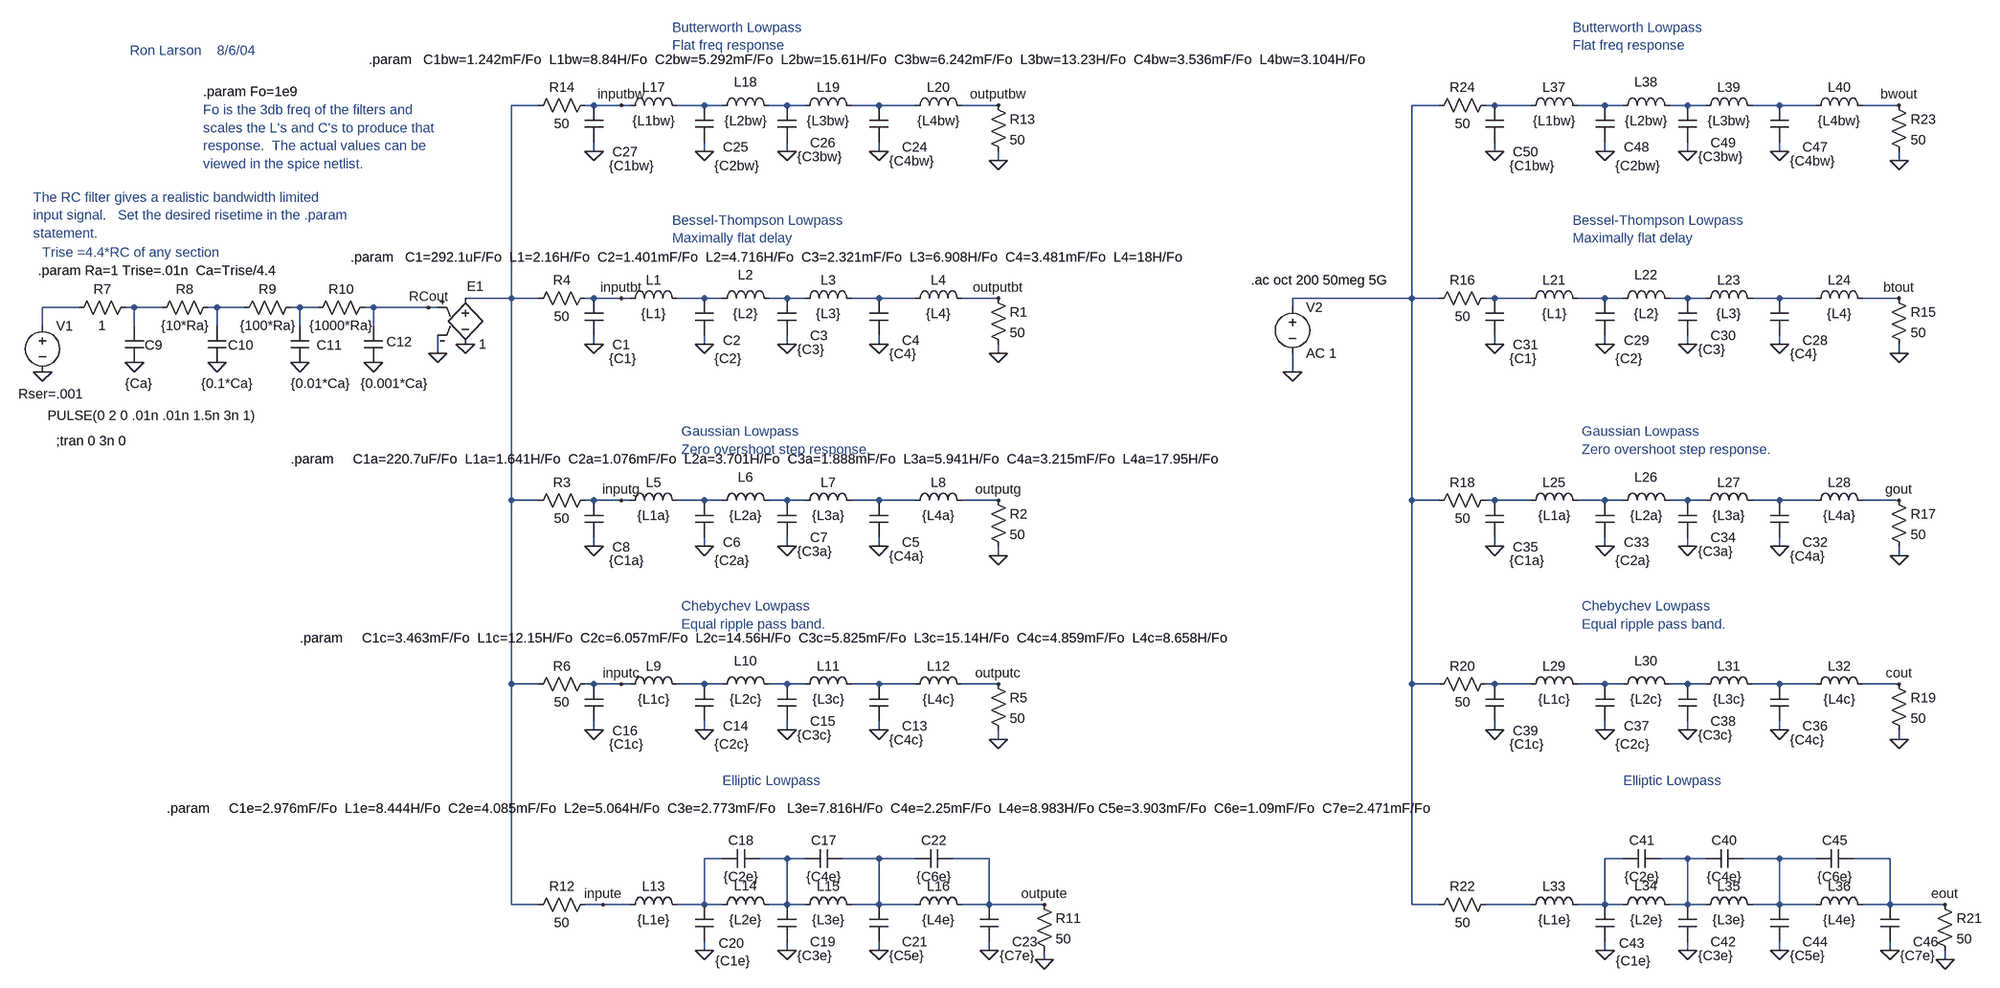
[diagram p0: schematic filters_galore.asc]
filters_galore.asc, the LTspice schematic file:
Version 4
SHEET 1 1564 1292
WIRE -592 112 -560 112
WIRE -832 112 -848 112
WIRE -1856 160 -1856 128
WIRE -992 112 -1040 112
WIRE -192 208 -192 192
WIRE -848 112 -896 112
WIRE -400 112 -336 112
WIRE -400 176 -400 192
WIRE -752 112 -704 112
WIRE -704 176 -704 192
WIRE -704 112 -672 112
WIRE -448 112 -400 112
WIRE -560 176 -560 192
WIRE -560 112 -528 112
WIRE -256 112 -192 112
WIRE -1280 128 -1184 128
WIRE -1184 128 -1168 128
WIRE -1168 176 -1168 208
WIRE -1856 128 -1792 128
WIRE -1712 128 -1696 128
WIRE -1696 160 -1696 128
WIRE -1696 128 -1648 128
WIRE -1568 128 -1552 128
WIRE -1552 160 -1552 128
WIRE -1552 128 -1504 128
WIRE -1424 128 -1408 128
WIRE -1296 128 -1280 128
WIRE -1280 128 -1280 160
WIRE -1408 160 -1408 128
WIRE -1408 128 -1376 128
WIRE -896 176 -896 192
WIRE -896 112 -912 112
WIRE -592 464 -560 464
WIRE -832 464 -848 464
WIRE -192 560 -192 544
WIRE -848 464 -896 464
WIRE -400 464 -336 464
WIRE -400 528 -400 544
WIRE -752 464 -704 464
WIRE -704 528 -704 544
WIRE -704 464 -672 464
WIRE -448 464 -400 464
WIRE -560 528 -560 544
WIRE -560 464 -528 464
WIRE -256 464 -192 464
WIRE -896 528 -896 544
WIRE -896 464 -912 464
WIRE -992 464 -1040 464
WIRE -1040 464 -1040 112
WIRE -1040 112 -1120 112
WIRE -592 784 -560 784
WIRE -832 784 -848 784
WIRE -192 880 -192 864
WIRE -848 784 -896 784
WIRE -400 784 -336 784
WIRE -400 848 -400 864
WIRE -752 784 -704 784
WIRE -704 848 -704 864
WIRE -704 784 -672 784
WIRE -448 784 -400 784
WIRE -560 848 -560 864
WIRE -560 784 -528 784
WIRE -256 784 -192 784
WIRE -896 848 -896 864
WIRE -896 784 -912 784
WIRE -992 784 -1040 784
WIRE -1040 784 -1040 464
WIRE -592 1168 -560 1168
WIRE -832 1168 -880 1168
WIRE -112 1264 -112 1248
WIRE -448 1168 -400 1168
WIRE -400 1232 -400 1248
WIRE -752 1168 -704 1168
WIRE -704 1232 -704 1248
WIRE -560 1232 -560 1248
WIRE -560 1168 -528 1168
WIRE -256 1168 -208 1168
WIRE -992 1168 -1040 1168
WIRE -1040 1168 -1040 784
WIRE -704 1168 -672 1168
WIRE -880 1168 -912 1168
WIRE -400 1168 -336 1168
WIRE -208 1232 -208 1248
WIRE -208 1168 -112 1168
WIRE -704 1168 -704 1088
WIRE -704 1088 -672 1088
WIRE -608 1088 -560 1088
WIRE -464 1088 -400 1088
WIRE -272 1088 -208 1088
WIRE -208 1088 -208 1168
WIRE -400 1168 -400 1088
WIRE -400 1088 -336 1088
WIRE -560 1168 -560 1088
WIRE -560 1088 -528 1088
WIRE -592 -224 -560 -224
WIRE -832 -224 -848 -224
WIRE -192 -128 -192 -144
WIRE -848 -224 -896 -224
WIRE -400 -224 -336 -224
WIRE -400 -160 -400 -144
WIRE -752 -224 -704 -224
WIRE -704 -160 -704 -144
WIRE -704 -224 -672 -224
WIRE -448 -224 -400 -224
WIRE -560 -160 -560 -144
WIRE -560 -224 -528 -224
WIRE -256 -224 -192 -224
WIRE -896 -160 -896 -144
WIRE -896 -224 -912 -224
WIRE -1040 112 -1040 -224
WIRE -1040 -224 -992 -224
WIRE 976 112 1008 112
WIRE 736 112 672 112
WIRE 576 112 528 112
WIRE 1376 208 1376 192
WIRE 1168 112 1232 112
WIRE 1168 176 1168 192
WIRE 816 112 864 112
WIRE 864 176 864 192
WIRE 864 112 896 112
WIRE 1120 112 1168 112
WIRE 1008 176 1008 192
WIRE 1008 112 1040 112
WIRE 1312 112 1376 112
WIRE 672 176 672 192
WIRE 672 112 656 112
WIRE 976 464 1008 464
WIRE 736 464 672 464
WIRE 1376 560 1376 544
WIRE 1168 464 1232 464
WIRE 1168 528 1168 544
WIRE 816 464 864 464
WIRE 864 528 864 544
WIRE 864 464 896 464
WIRE 1120 464 1168 464
WIRE 1008 528 1008 544
WIRE 1008 464 1040 464
WIRE 1312 464 1376 464
WIRE 672 528 672 544
WIRE 672 464 656 464
WIRE 576 464 528 464
WIRE 528 464 528 112
WIRE 976 784 1008 784
WIRE 736 784 672 784
WIRE 1376 880 1376 864
WIRE 1168 784 1232 784
WIRE 1168 848 1168 864
WIRE 816 784 864 784
WIRE 864 848 864 864
WIRE 864 784 896 784
WIRE 1120 784 1168 784
WIRE 1008 848 1008 864
WIRE 1008 784 1040 784
WIRE 1312 784 1376 784
WIRE 672 848 672 864
WIRE 672 784 656 784
WIRE 576 784 528 784
WIRE 528 784 528 464
WIRE 976 1168 1008 1168
WIRE 736 1168 656 1168
WIRE 1456 1264 1456 1248
WIRE 1120 1168 1168 1168
WIRE 1168 1232 1168 1248
WIRE 816 1168 864 1168
WIRE 864 1232 864 1248
WIRE 1008 1232 1008 1248
WIRE 1008 1168 1040 1168
WIRE 1312 1168 1360 1168
WIRE 576 1168 528 1168
WIRE 528 1168 528 784
WIRE 864 1168 896 1168
WIRE 1168 1168 1232 1168
WIRE 1360 1232 1360 1248
WIRE 1360 1168 1456 1168
WIRE 864 1168 864 1088
WIRE 864 1088 896 1088
WIRE 960 1088 1008 1088
WIRE 1104 1088 1168 1088
WIRE 1296 1088 1360 1088
WIRE 1360 1088 1360 1168
WIRE 1168 1168 1168 1088
WIRE 1168 1088 1232 1088
WIRE 1008 1168 1008 1088
WIRE 1008 1088 1040 1088
WIRE 976 -224 1008 -224
WIRE 736 -224 672 -224
WIRE 1376 -128 1376 -144
WIRE 1168 -224 1232 -224
WIRE 1168 -160 1168 -144
WIRE 816 -224 864 -224
WIRE 864 -160 864 -144
WIRE 864 -224 896 -224
WIRE 1120 -224 1168 -224
WIRE 1008 -160 1008 -144
WIRE 1008 -224 1040 -224
WIRE 1312 -224 1376 -224
WIRE 672 -160 672 -144
WIRE 672 -224 656 -224
WIRE 528 112 528 -224
WIRE 528 -224 576 -224
WIRE 320 240 320 208
WIRE 320 128 320 112
WIRE 320 112 528 112
FLAG -192 208 0
FLAG -1856 240 0
FLAG -848 112 inputbt
FLAG -192 112 outputbt
FLAG -400 192 0
FLAG -704 192 0
FLAG -560 192 0
FLAG -1120 192 0
FLAG -1168 208 0
FLAG -1184 128 RCout
FLAG -1280 224 0
FLAG -1408 224 0
FLAG -1552 224 0
FLAG -1696 224 0
FLAG -896 192 0
FLAG -192 560 0
FLAG -848 464 inputg
FLAG -192 464 outputg
FLAG -400 544 0
FLAG -704 544 0
FLAG -560 544 0
FLAG -896 544 0
FLAG -192 880 0
FLAG -848 784 inputc
FLAG -192 784 outputc
FLAG -400 864 0
FLAG -704 864 0
FLAG -560 864 0
FLAG -896 864 0
FLAG -112 1264 0
FLAG -880 1168 inpute
FLAG -112 1168 outpute
FLAG -400 1248 0
FLAG -704 1248 0
FLAG -560 1248 0
FLAG -208 1248 0
FLAG -192 -128 0
FLAG -848 -224 inputbw
FLAG -192 -224 outputbw
FLAG -400 -144 0
FLAG -704 -144 0
FLAG -560 -144 0
FLAG -896 -144 0
FLAG 1376 208 0
FLAG 1376 112 btout
FLAG 1168 192 0
FLAG 864 192 0
FLAG 1008 192 0
FLAG 672 192 0
FLAG 1376 560 0
FLAG 1376 464 gout
FLAG 1168 544 0
FLAG 864 544 0
FLAG 1008 544 0
FLAG 672 544 0
FLAG 1376 880 0
FLAG 1376 784 cout
FLAG 1168 864 0
FLAG 864 864 0
FLAG 1008 864 0
FLAG 672 864 0
FLAG 1456 1264 0
FLAG 1456 1168 eout
FLAG 1168 1248 0
FLAG 864 1248 0
FLAG 1008 1248 0
FLAG 1360 1248 0
FLAG 1376 -128 0
FLAG 1376 -224 bwout
FLAG 1168 -144 0
FLAG 864 -144 0
FLAG 1008 -144 0
FLAG 672 -144 0
FLAG 320 240 0
SYMBOL res -208 96 R0
SYMATTR InstName R1
SYMATTR Value 50
SYMBOL ind -848 128 R270
WINDOW 0 32 56 VTop 0
WINDOW 3 5 56 VBottom 0
SYMATTR InstName L1
SYMATTR Value {L1}
SYMBOL voltage -1856 144 R0
WINDOW 3 9 172 Left 0
WINDOW 123 0 0 Left 0
WINDOW 39 -42 135 Left 0
SYMATTR Value PULSE(0 2 0 .01n .01n 1.5n 3n 1)
SYMATTR SpiceLine Rser=.001
SYMATTR InstName V1
SYMBOL res -896 96 R90
WINDOW 0 0 56 VBottom 0
WINDOW 3 32 56 VTop 0
SYMATTR InstName R4
SYMATTR Value 50
SYMBOL cap -416 112 R0
WINDOW 3 34 97 Left 0
WINDOW 0 56 73 Left 0
SYMATTR Value {C4}
SYMATTR InstName C4
SYMBOL ind -688 128 R270
WINDOW 0 41 56 VTop 0
WINDOW 3 5 56 VBottom 0
SYMATTR InstName L2
SYMATTR Value {L2}
SYMBOL cap -720 112 R0
WINDOW 3 34 105 Left 0
WINDOW 0 49 73 Left 0
SYMATTR Value {C2}
SYMATTR InstName C2
SYMBOL ind -544 128 R270
WINDOW 0 32 56 VTop 0
WINDOW 3 5 56 VBottom 0
SYMATTR InstName L3
SYMATTR Value {L3}
SYMBOL cap -576 112 R0
WINDOW 3 34 89 Left 0
WINDOW 0 56 65 Left 0
SYMATTR Value {C3}
SYMATTR InstName C3
SYMBOL ind -352 128 R270
WINDOW 0 32 56 VTop 0
WINDOW 3 5 56 VBottom 0
SYMATTR InstName L4
SYMATTR Value {L4}
SYMBOL e -1120 96 R0
WINDOW 0 3 -5 Left 0
SYMATTR InstName E1
SYMATTR Value 1
SYMBOL res -1696 112 R90
WINDOW 0 0 56 VBottom 0
WINDOW 3 32 56 VTop 0
SYMATTR InstName R7
SYMATTR Value 1
SYMBOL res -1552 112 R90
WINDOW 0 0 56 VBottom 0
WINDOW 3 32 56 VTop 0
SYMATTR InstName R8
SYMATTR Value {10*Ra}
SYMBOL res -1408 112 R90
WINDOW 0 0 56 VBottom 0
WINDOW 3 32 56 VTop 0
SYMATTR InstName R9
SYMATTR Value {100*Ra}
SYMBOL res -1280 112 R90
WINDOW 0 0 56 VBottom 0
WINDOW 3 32 56 VTop 0
SYMATTR InstName R10
SYMATTR Value {1000*Ra}
SYMBOL cap -1712 160 R0
WINDOW 3 0 100 Left 0
WINDOW 0 34 34 Left 0
SYMATTR Value {Ca}
SYMATTR InstName C9
SYMBOL cap -1568 160 R0
WINDOW 3 -12 100 Left 0
WINDOW 0 35 34 Left 0
SYMATTR Value {0.1*Ca}
SYMATTR InstName C10
SYMBOL cap -1424 160 R0
WINDOW 3 0 100 Left 0
WINDOW 0 45 34 Left 0
SYMATTR Value {0.01*Ca}
SYMATTR InstName C11
SYMBOL cap -1296 160 R0
WINDOW 3 -6 100 Left 0
WINDOW 0 39 28 Left 0
SYMATTR Value {0.001*Ca}
SYMATTR InstName C12
SYMBOL cap -912 112 R0
WINDOW 3 42 105 Left 0
WINDOW 0 48 81 Left 0
SYMATTR Value {C1}
SYMATTR InstName C1
SYMBOL res -208 448 R0
SYMATTR InstName R2
SYMATTR Value 50
SYMBOL ind -848 480 R270
WINDOW 0 32 56 VTop 0
WINDOW 3 5 56 VBottom 0
SYMATTR InstName L5
SYMATTR Value {L1a}
SYMBOL res -896 448 R90
WINDOW 0 0 56 VBottom 0
WINDOW 3 32 56 VTop 0
SYMATTR InstName R3
SYMATTR Value 50
SYMBOL cap -416 464 R0
WINDOW 3 34 97 Left 0
WINDOW 0 56 73 Left 0
SYMATTR Value {C4a}
SYMATTR InstName C5
SYMBOL ind -688 480 R270
WINDOW 0 41 56 VTop 0
WINDOW 3 5 56 VBottom 0
SYMATTR InstName L6
SYMATTR Value {L2a}
SYMBOL cap -720 464 R0
WINDOW 3 34 105 Left 0
WINDOW 0 49 73 Left 0
SYMATTR Value {C2a}
SYMATTR InstName C6
SYMBOL ind -544 480 R270
WINDOW 0 32 56 VTop 0
WINDOW 3 5 56 VBottom 0
SYMATTR InstName L7
SYMATTR Value {L3a}
SYMBOL cap -576 464 R0
WINDOW 3 34 89 Left 0
WINDOW 0 56 65 Left 0
SYMATTR Value {C3a}
SYMATTR InstName C7
SYMBOL ind -352 480 R270
WINDOW 0 32 56 VTop 0
WINDOW 3 5 56 VBottom 0
SYMATTR InstName L8
SYMATTR Value {L4a}
SYMBOL cap -912 464 R0
WINDOW 3 42 105 Left 0
WINDOW 0 48 81 Left 0
SYMATTR Value {C1a}
SYMATTR InstName C8
SYMBOL res -208 768 R0
SYMATTR InstName R5
SYMATTR Value 50
SYMBOL ind -848 800 R270
WINDOW 0 32 56 VTop 0
WINDOW 3 5 56 VBottom 0
SYMATTR InstName L9
SYMATTR Value {L1c}
SYMBOL res -896 768 R90
WINDOW 0 0 56 VBottom 0
WINDOW 3 32 56 VTop 0
SYMATTR InstName R6
SYMATTR Value 50
SYMBOL cap -416 784 R0
WINDOW 3 34 97 Left 0
WINDOW 0 56 73 Left 0
SYMATTR Value {C4c}
SYMATTR InstName C13
SYMBOL ind -688 800 R270
WINDOW 0 41 56 VTop 0
WINDOW 3 5 56 VBottom 0
SYMATTR InstName L10
SYMATTR Value {L2c}
SYMBOL cap -720 784 R0
WINDOW 3 34 105 Left 0
WINDOW 0 49 73 Left 0
SYMATTR Value {C2c}
SYMATTR InstName C14
SYMBOL ind -544 800 R270
WINDOW 0 32 56 VTop 0
WINDOW 3 5 56 VBottom 0
SYMATTR InstName L11
SYMATTR Value {L3c}
SYMBOL cap -576 784 R0
WINDOW 3 34 89 Left 0
WINDOW 0 56 65 Left 0
SYMATTR Value {C3c}
SYMATTR InstName C15
SYMBOL ind -352 800 R270
WINDOW 0 32 56 VTop 0
WINDOW 3 5 56 VBottom 0
SYMATTR InstName L12
SYMATTR Value {L4c}
SYMBOL cap -912 784 R0
WINDOW 3 42 105 Left 0
WINDOW 0 48 81 Left 0
SYMATTR Value {C1c}
SYMATTR InstName C16
SYMBOL res -128 1152 R0
SYMATTR InstName R11
SYMATTR Value 50
SYMBOL ind -848 1184 R270
WINDOW 0 32 56 VTop 0
WINDOW 3 5 56 VBottom 0
SYMATTR InstName L13
SYMATTR Value {L1e}
SYMBOL res -896 1152 R90
WINDOW 0 0 56 VBottom 0
WINDOW 3 32 56 VTop 0
SYMATTR InstName R12
SYMATTR Value 50
SYMBOL cap -528 1104 R270
WINDOW 3 0 32 VBottom 0
WINDOW 0 32 32 VTop 0
SYMATTR Value {C4e}
SYMATTR InstName C17
SYMBOL ind -688 1184 R270
WINDOW 0 33 56 VTop 0
WINDOW 3 5 56 VBottom 0
SYMATTR InstName L14
SYMATTR Value {L2e}
SYMBOL cap -672 1104 R270
WINDOW 3 0 32 VBottom 0
WINDOW 0 32 32 VTop 0
SYMATTR Value {C2e}
SYMATTR InstName C18
SYMBOL ind -544 1184 R270
WINDOW 0 32 56 VTop 0
WINDOW 3 5 56 VBottom 0
SYMATTR InstName L15
SYMATTR Value {L3e}
SYMBOL cap -576 1168 R0
WINDOW 3 34 89 Left 0
WINDOW 0 56 65 Left 0
SYMATTR Value {C3e}
SYMATTR InstName C19
SYMBOL ind -352 1184 R270
WINDOW 0 32 56 VTop 0
WINDOW 3 5 56 VBottom 0
SYMATTR InstName L16
SYMATTR Value {L4e}
SYMBOL cap -720 1168 R0
WINDOW 3 35 98 Left 0
WINDOW 0 41 67 Left 0
SYMATTR Value {C1e}
SYMATTR InstName C20
SYMBOL cap -416 1168 R0
WINDOW 3 34 89 Left 0
WINDOW 0 56 65 Left 0
SYMATTR Value {C5e}
SYMATTR InstName C21
SYMBOL cap -336 1104 R270
WINDOW 3 0 32 VBottom 0
WINDOW 0 32 32 VTop 0
SYMATTR Value {C6e}
SYMATTR InstName C22
SYMBOL cap -224 1168 R0
WINDOW 3 34 89 Left 0
WINDOW 0 56 65 Left 0
SYMATTR Value {C7e}
SYMATTR InstName C23
SYMBOL res -208 -240 R0
SYMATTR InstName R13
SYMATTR Value 50
SYMBOL ind -848 -208 R270
WINDOW 0 32 56 VTop 0
WINDOW 3 5 56 VBottom 0
SYMATTR InstName L17
SYMATTR Value {L1bw}
SYMBOL res -896 -240 R90
WINDOW 0 0 56 VBottom 0
WINDOW 3 32 56 VTop 0
SYMATTR InstName R14
SYMATTR Value 50
SYMBOL cap -416 -224 R0
WINDOW 3 34 97 Left 0
WINDOW 0 56 73 Left 0
SYMATTR Value {C4bw}
SYMATTR InstName C24
SYMBOL ind -688 -208 R270
WINDOW 0 41 56 VTop 0
WINDOW 3 5 56 VBottom 0
SYMATTR InstName L18
SYMATTR Value {L2bw}
SYMBOL cap -720 -224 R0
WINDOW 3 34 105 Left 0
WINDOW 0 49 73 Left 0
SYMATTR Value {C2bw}
SYMATTR InstName C25
SYMBOL ind -544 -208 R270
WINDOW 0 32 56 VTop 0
WINDOW 3 5 56 VBottom 0
SYMATTR InstName L19
SYMATTR Value {L3bw}
SYMBOL cap -576 -224 R0
WINDOW 3 34 89 Left 0
WINDOW 0 56 65 Left 0
SYMATTR Value {C3bw}
SYMATTR InstName C26
SYMBOL ind -352 -208 R270
WINDOW 0 32 56 VTop 0
WINDOW 3 5 56 VBottom 0
SYMATTR InstName L20
SYMATTR Value {L4bw}
SYMBOL cap -912 -224 R0
WINDOW 3 42 105 Left 0
WINDOW 0 48 81 Left 0
SYMATTR Value {C1bw}
SYMATTR InstName C27
SYMBOL res 1360 96 R0
SYMATTR InstName R15
SYMATTR Value 50
SYMBOL ind 720 128 R270
WINDOW 0 32 56 VTop 0
WINDOW 3 5 56 VBottom 0
SYMATTR InstName L21
SYMATTR Value {L1}
SYMBOL res 672 96 R90
WINDOW 0 0 56 VBottom 0
WINDOW 3 32 56 VTop 0
SYMATTR InstName R16
SYMATTR Value 50
SYMBOL cap 1152 112 R0
WINDOW 3 34 97 Left 0
WINDOW 0 56 73 Left 0
SYMATTR Value {C4}
SYMATTR InstName C28
SYMBOL ind 880 128 R270
WINDOW 0 41 56 VTop 0
WINDOW 3 5 56 VBottom 0
SYMATTR InstName L22
SYMATTR Value {L2}
SYMBOL cap 848 112 R0
WINDOW 3 34 105 Left 0
WINDOW 0 49 73 Left 0
SYMATTR Value {C2}
SYMATTR InstName C29
SYMBOL ind 1024 128 R270
WINDOW 0 32 56 VTop 0
WINDOW 3 5 56 VBottom 0
SYMATTR InstName L23
SYMATTR Value {L3}
SYMBOL cap 992 112 R0
WINDOW 3 34 89 Left 0
WINDOW 0 56 65 Left 0
SYMATTR Value {C3}
SYMATTR InstName C30
SYMBOL ind 1216 128 R270
WINDOW 0 32 56 VTop 0
WINDOW 3 5 56 VBottom 0
SYMATTR InstName L24
SYMATTR Value {L4}
SYMBOL cap 656 112 R0
WINDOW 3 42 105 Left 0
WINDOW 0 48 81 Left 0
SYMATTR Value {C1}
SYMATTR InstName C31
SYMBOL res 1360 448 R0
SYMATTR InstName R17
SYMATTR Value 50
SYMBOL ind 720 480 R270
WINDOW 0 32 56 VTop 0
WINDOW 3 5 56 VBottom 0
SYMATTR InstName L25
SYMATTR Value {L1a}
SYMBOL res 672 448 R90
WINDOW 0 0 56 VBottom 0
WINDOW 3 32 56 VTop 0
SYMATTR InstName R18
SYMATTR Value 50
SYMBOL cap 1152 464 R0
WINDOW 3 34 97 Left 0
WINDOW 0 56 73 Left 0
SYMATTR Value {C4a}
SYMATTR InstName C32
SYMBOL ind 880 480 R270
WINDOW 0 41 56 VTop 0
WINDOW 3 5 56 VBottom 0
SYMATTR InstName L26
SYMATTR Value {L2a}
SYMBOL cap 848 464 R0
WINDOW 3 34 105 Left 0
WINDOW 0 49 73 Left 0
SYMATTR Value {C2a}
SYMATTR InstName C33
SYMBOL ind 1024 480 R270
WINDOW 0 32 56 VTop 0
WINDOW 3 5 56 VBottom 0
SYMATTR InstName L27
SYMATTR Value {L3a}
SYMBOL cap 992 464 R0
WINDOW 3 34 89 Left 0
WINDOW 0 56 65 Left 0
SYMATTR Value {C3a}
SYMATTR InstName C34
SYMBOL ind 1216 480 R270
WINDOW 0 32 56 VTop 0
WINDOW 3 5 56 VBottom 0
SYMATTR InstName L28
SYMATTR Value {L4a}
SYMBOL cap 656 464 R0
WINDOW 3 42 105 Left 0
WINDOW 0 48 81 Left 0
SYMATTR Value {C1a}
SYMATTR InstName C35
SYMBOL res 1360 768 R0
SYMATTR InstName R19
SYMATTR Value 50
SYMBOL ind 720 800 R270
WINDOW 0 32 56 VTop 0
WINDOW 3 5 56 VBottom 0
SYMATTR InstName L29
SYMATTR Value {L1c}
SYMBOL res 672 768 R90
WINDOW 0 0 56 VBottom 0
WINDOW 3 32 56 VTop 0
SYMATTR InstName R20
SYMATTR Value 50
SYMBOL cap 1152 784 R0
WINDOW 3 34 97 Left 0
WINDOW 0 56 73 Left 0
SYMATTR Value {C4c}
SYMATTR InstName C36
SYMBOL ind 880 800 R270
WINDOW 0 41 56 VTop 0
WINDOW 3 5 56 VBottom 0
SYMATTR InstName L30
SYMATTR Value {L2c}
SYMBOL cap 848 784 R0
WINDOW 3 34 105 Left 0
WINDOW 0 49 73 Left 0
SYMATTR Value {C2c}
SYMATTR InstName C37
SYMBOL ind 1024 800 R270
WINDOW 0 32 56 VTop 0
WINDOW 3 5 56 VBottom 0
SYMATTR InstName L31
SYMATTR Value {L3c}
SYMBOL cap 992 784 R0
WINDOW 3 34 89 Left 0
WINDOW 0 56 65 Left 0
SYMATTR Value {C3c}
SYMATTR InstName C38
SYMBOL ind 1216 800 R270
WINDOW 0 32 56 VTop 0
WINDOW 3 5 56 VBottom 0
SYMATTR InstName L32
SYMATTR Value {L4c}
SYMBOL cap 656 784 R0
WINDOW 3 42 105 Left 0
WINDOW 0 48 81 Left 0
SYMATTR Value {C1c}
SYMATTR InstName C39
SYMBOL res 1440 1152 R0
SYMATTR InstName R21
SYMATTR Value 50
SYMBOL ind 720 1184 R270
WINDOW 0 32 56 VTop 0
WINDOW 3 5 56 VBottom 0
SYMATTR InstName L33
SYMATTR Value {L1e}
SYMBOL res 672 1152 R90
WINDOW 0 0 56 VBottom 0
WINDOW 3 32 56 VTop 0
SYMATTR InstName R22
SYMATTR Value 50
SYMBOL cap 1040 1104 R270
WINDOW 3 0 32 VBottom 0
WINDOW 0 32 32 VTop 0
SYMATTR Value {C4e}
SYMATTR InstName C40
SYMBOL ind 880 1184 R270
WINDOW 0 33 56 VTop 0
WINDOW 3 5 56 VBottom 0
SYMATTR InstName L34
SYMATTR Value {L2e}
SYMBOL cap 896 1104 R270
WINDOW 3 0 32 VBottom 0
WINDOW 0 32 32 VTop 0
SYMATTR Value {C2e}
SYMATTR InstName C41
SYMBOL ind 1024 1184 R270
WINDOW 0 32 56 VTop 0
WINDOW 3 5 56 VBottom 0
SYMATTR InstName L35
SYMATTR Value {L3e}
SYMBOL cap 992 1168 R0
WINDOW 3 34 89 Left 0
WINDOW 0 56 65 Left 0
SYMATTR Value {C3e}
SYMATTR InstName C42
SYMBOL ind 1216 1184 R270
WINDOW 0 32 56 VTop 0
WINDOW 3 5 56 VBottom 0
SYMATTR InstName L36
SYMATTR Value {L4e}
SYMBOL cap 848 1168 R0
WINDOW 3 35 98 Left 0
WINDOW 0 41 67 Left 0
SYMATTR Value {C1e}
SYMATTR InstName C43
SYMBOL cap 1152 1168 R0
WINDOW 3 34 89 Left 0
WINDOW 0 56 65 Left 0
SYMATTR Value {C5e}
SYMATTR InstName C44
SYMBOL cap 1232 1104 R270
WINDOW 3 0 32 VBottom 0
WINDOW 0 32 32 VTop 0
SYMATTR Value {C6e}
SYMATTR InstName C45
SYMBOL cap 1344 1168 R0
WINDOW 3 34 89 Left 0
WINDOW 0 56 65 Left 0
SYMATTR Value {C7e}
SYMATTR InstName C46
SYMBOL res 1360 -240 R0
SYMATTR InstName R23
SYMATTR Value 50
SYMBOL ind 720 -208 R270
WINDOW 0 32 56 VTop 0
WINDOW 3 5 56 VBottom 0
SYMATTR InstName L37
SYMATTR Value {L1bw}
SYMBOL res 672 -240 R90
WINDOW 0 0 56 VBottom 0
WINDOW 3 32 56 VTop 0
SYMATTR InstName R24
SYMATTR Value 50
SYMBOL cap 1152 -224 R0
WINDOW 3 34 97 Left 0
WINDOW 0 56 73 Left 0
SYMATTR Value {C4bw}
SYMATTR InstName C47
SYMBOL ind 880 -208 R270
WINDOW 0 41 56 VTop 0
WINDOW 3 5 56 VBottom 0
SYMATTR InstName L38
SYMATTR Value {L2bw}
SYMBOL cap 848 -224 R0
WINDOW 3 34 105 Left 0
WINDOW 0 49 73 Left 0
SYMATTR Value {C2bw}
SYMATTR InstName C48
SYMBOL ind 1024 -208 R270
WINDOW 0 32 56 VTop 0
WINDOW 3 5 56 VBottom 0
SYMATTR InstName L39
SYMATTR Value {L3bw}
SYMBOL cap 992 -224 R0
WINDOW 3 34 89 Left 0
WINDOW 0 56 65 Left 0
SYMATTR Value {C3bw}
SYMATTR InstName C49
SYMBOL ind 1216 -208 R270
WINDOW 0 32 56 VTop 0
WINDOW 3 5 56 VBottom 0
SYMATTR InstName L40
SYMATTR Value {L4bw}
SYMBOL cap 656 -224 R0
WINDOW 3 42 105 Left 0
WINDOW 0 48 81 Left 0
SYMATTR Value {C1bw}
SYMATTR InstName C50
SYMBOL voltage 320 112 R0
SYMATTR InstName V2
SYMATTR Value AC 1
TEXT -1832 360 Left 0 !;tran 0 3n 0
TEXT -760 -24 Left 0 ;Bessel-Thompson Lowpass\nMaximally flat delay
TEXT -1864 64 Left 0 !.param Ra=1 Trise=.01n  Ca=Trise/4.4
TEXT -1856 32 Left 0 ;Trise =4.4*RC of any section
TEXT -1320 40 Left 0 !.param   C1=292.1uF/Fo  L1=2.16H/Fo  C2=1.401mF/Fo  L2=4.716H/Fo  C3=2.321mF/Fo  L3=6.908H/Fo  C4=3.481mF/Fo  L4=18H/Fo
TEXT -1424 392 Left 0 !.param     C1a=220.7uF/Fo  L1a=1.641H/Fo  C2a=1.076mF/Fo  L2a=3.701H/Fo  C3a=1.888mF/Fo  L3a=5.941H/Fo  C4a=3.215mF/Fo  L4a=17.95H/Fo
TEXT -744 344 Left 0 ;Gaussian Lowpass\nZero overshoot step response.
TEXT -1576 -248 Left 0 !.param Fo=1e9
TEXT -744 648 Left 0 ;Chebychev Lowpass\nEqual ripple pass band.
TEXT -1408 704 Left 0 !.param     C1c=3.463mF/Fo  L1c=12.15H/Fo  C2c=6.057mF/Fo  L2c=14.56H/Fo  C3c=5.825mF/Fo  L3c=15.14H/Fo  C4c=4.859mF/Fo  L4c=8.658H/Fo
TEXT -672 952 Left 0 ;Elliptic Lowpass
TEXT -1640 1000 Left 0 !.param     C1e=2.976mF/Fo  L1e=8.444H/Fo  C2e=4.085mF/Fo  L2e=5.064H/Fo  C3e=2.773mF/Fo   L3e=7.816H/Fo  C4e=2.25mF/Fo  L4e=8.983H/Fo C5e=3.903mF/Fo  C6e=1.09mF/Fo  C7e=2.471mF/Fo
TEXT -760 -360 Left 0 ;Butterworth Lowpass\nFlat freq response
TEXT -1288 -304 Left 0 !.param   C1bw=1.242mF/Fo  L1bw=8.84H/Fo  C2bw=5.292mF/Fo  L2bw=15.61H/Fo  C3bw=6.242mF/Fo  L3bw=13.23H/Fo  C4bw=3.536mF/Fo  L4bw=3.104H/Fo
TEXT -1576 -216 Left 0 ;Fo is the 3db freq of the filters and\nscales the L's and C's to produce that\nresponse.  The actual values can be\nviewed in the spice netlist.
TEXT -1872 -64 Left 0 ;The RC filter gives a realistic bandwidth limited\ninput signal.   Set the desired risetime in the .param\nstatement.
TEXT -1704 -320 Left 0 ;Ron Larson    8/6/04
TEXT 808 -24 Left 0 ;Bessel-Thompson Lowpass\nMaximally flat delay
TEXT 824 344 Left 0 ;Gaussian Lowpass\nZero overshoot step response.
TEXT 824 648 Left 0 ;Chebychev Lowpass\nEqual ripple pass band.
TEXT 896 952 Left 0 ;Elliptic Lowpass
TEXT 808 -360 Left 0 ;Butterworth Lowpass\nFlat freq response
TEXT 248 80 Left 0 !.ac oct 200 50meg 5G

The netlist it stands for:
* filters_galore.asc
R1 outputbt 0 50
L1 inputbt N005 {L1}
V1 N002 0 PULSE(0 2 0 .01n .01n 1.5n 3n 1) Rser=.001
R4 inputbt N003 50
C4 N004 0 {C4}
L2 N005 N001 {L2}
C2 N005 0 {C2}
L3 N001 N004 {L3}
C3 N001 0 {C3}
L4 N004 outputbt {L4}
E1 N003 0 RCout 0 1
R7 N006 N002 1
R8 N007 N006 {10*Ra}
R9 N008 N007 {100*Ra}
R10 RCout N008 {1000*Ra}
C9 N006 0 {Ca}
C10 N007 0 {0.1*Ca}
C11 N008 0 {0.01*Ca}
C12 RCout 0 {0.001*Ca}
C1 inputbt 0 {C1}
R2 outputg 0 50
L5 inputg N011 {L1a}
R3 inputg N003 50
C5 N010 0 {C4a}
L6 N011 N009 {L2a}
C6 N011 0 {C2a}
L7 N009 N010 {L3a}
C7 N009 0 {C3a}
L8 N010 outputg {L4a}
C8 inputg 0 {C1a}
R5 outputc 0 50
L9 inputc N014 {L1c}
R6 inputc N003 50
C13 N013 0 {C4c}
L10 N014 N012 {L2c}
C14 N014 0 {C2c}
L11 N012 N013 {L3c}
C15 N012 0 {C3c}
L12 N013 outputc {L4c}
C16 inputc 0 {C1c}
R11 outpute 0 50
L13 inpute N017 {L1e}
R12 inpute N003 50
C17 N015 N016 {C4e}
L14 N017 N015 {L2e}
C18 N017 N015 {C2e}
L15 N015 N016 {L3e}
C19 N015 0 {C3e}
L16 N016 outpute {L4e}
C20 N017 0 {C1e}
C21 N016 0 {C5e}
C22 N016 outpute {C6e}
C23 outpute 0 {C7e}
R13 outputbw 0 50
L17 inputbw N020 {L1bw}
R14 inputbw N003 50
C24 N019 0 {C4bw}
L18 N020 N018 {L2bw}
C25 N020 0 {C2bw}
L19 N018 N019 {L3bw}
C26 N018 0 {C3bw}
L20 N019 outputbw {L4bw}
C27 inputbw 0 {C1bw}
R15 btout 0 50
L21 N022 N025 {L1}
R16 N022 N023 50
C28 N024 0 {C4}
L22 N025 N021 {L2}
C29 N025 0 {C2}
L23 N021 N024 {L3}
C30 N021 0 {C3}
L24 N024 btout {L4}
C31 N022 0 {C1}
R17 gout 0 50
L25 N027 N029 {L1a}
R18 N027 N023 50
C32 N028 0 {C4a}
L26 N029 N026 {L2a}
C33 N029 0 {C2a}
L27 N026 N028 {L3a}
C34 N026 0 {C3a}
L28 N028 gout {L4a}
C35 N027 0 {C1a}
R19 cout 0 50
L29 N031 N033 {L1c}
R20 N031 N023 50
C36 N032 0 {C4c}
L30 N033 N030 {L2c}
C37 N033 0 {C2c}
L31 N030 N032 {L3c}
C38 N030 0 {C3c}
L32 N032 cout {L4c}
C39 N031 0 {C1c}
R21 eout 0 50
L33 N035 N037 {L1e}
R22 N035 N023 50
C40 N034 N036 {C4e}
L34 N037 N034 {L2e}
C41 N037 N034 {C2e}
L35 N034 N036 {L3e}
C42 N034 0 {C3e}
L36 N036 eout {L4e}
C43 N037 0 {C1e}
C44 N036 0 {C5e}
C45 N036 eout {C6e}
C46 eout 0 {C7e}
R23 bwout 0 50
L37 N039 N041 {L1bw}
R24 N039 N023 50
C47 N040 0 {C4bw}
L38 N041 N038 {L2bw}
C48 N041 0 {C2bw}
L39 N038 N040 {L3bw}
C49 N038 0 {C3bw}
L40 N040 bwout {L4bw}
C50 N039 0 {C1bw}
V2 N023 0 AC 1
;tran 0 3n 0
* Bessel-Thompson Lowpass
* Maximally flat delay
.param Ra=1 Trise=.01n  Ca=Trise/4.4
* Trise =4.4*RC of any section
.param   C1=292.1uF/Fo  L1=2.16H/Fo  C2=1.401mF/Fo  L2=4.716H/Fo  C3=2.321mF/Fo  L3=6.908H/Fo  C4=3.481mF/Fo  L4=18H/Fo
.param     C1a=220.7uF/Fo  L1a=1.641H/Fo  C2a=1.076mF/Fo  L2a=3.701H/Fo  C3a=1.888mF/Fo  L3a=5.941H/Fo  C4a=3.215mF/Fo  L4a=17.95H/Fo
* Gaussian Lowpass
* Zero overshoot step response.
.param Fo=1e9
* Chebychev Lowpass
* Equal ripple pass band.
.param     C1c=3.463mF/Fo  L1c=12.15H/Fo  C2c=6.057mF/Fo  L2c=14.56H/Fo  C3c=5.825mF/Fo  L3c=15.14H/Fo  C4c=4.859mF/Fo  L4c=8.658H/Fo
* Elliptic Lowpass
.param     C1e=2.976mF/Fo  L1e=8.444H/Fo  C2e=4.085mF/Fo  L2e=5.064H/Fo  C3e=2.773mF/Fo   L3e=7.816H/Fo  C4e=2.25mF/Fo  L4e=8.983H/Fo C5e=3.903mF/Fo  C6e=1.09mF/Fo  C7e=2.471mF/Fo
* Butterworth Lowpass
* Flat freq response
.param   C1bw=1.242mF/Fo  L1bw=8.84H/Fo  C2bw=5.292mF/Fo  L2bw=15.61H/Fo  C3bw=6.242mF/Fo  L3bw=13.23H/Fo  C4bw=3.536mF/Fo  L4bw=3.104H/Fo
* Fo is the 3db freq of the filters and
* scales the L's and C's to produce that
* response.  The actual values can be
* viewed in the spice netlist.
* The RC filter gives a realistic bandwidth limited
* input signal.   Set the desired risetime in the .param
* statement.
* Ron Larson    8/6/04
* Bessel-Thompson Lowpass
* Maximally flat delay
* Gaussian Lowpass
* Zero overshoot step response.
* Chebychev Lowpass
* Equal ripple pass band.
* Elliptic Lowpass
* Butterworth Lowpass
* Flat freq response
.ac oct 200 50meg 5G
.backanno
.end